# Altium schematic sheet Generator.SchDoc
size 420 x 297 mm; DocumentNumber: Audio core
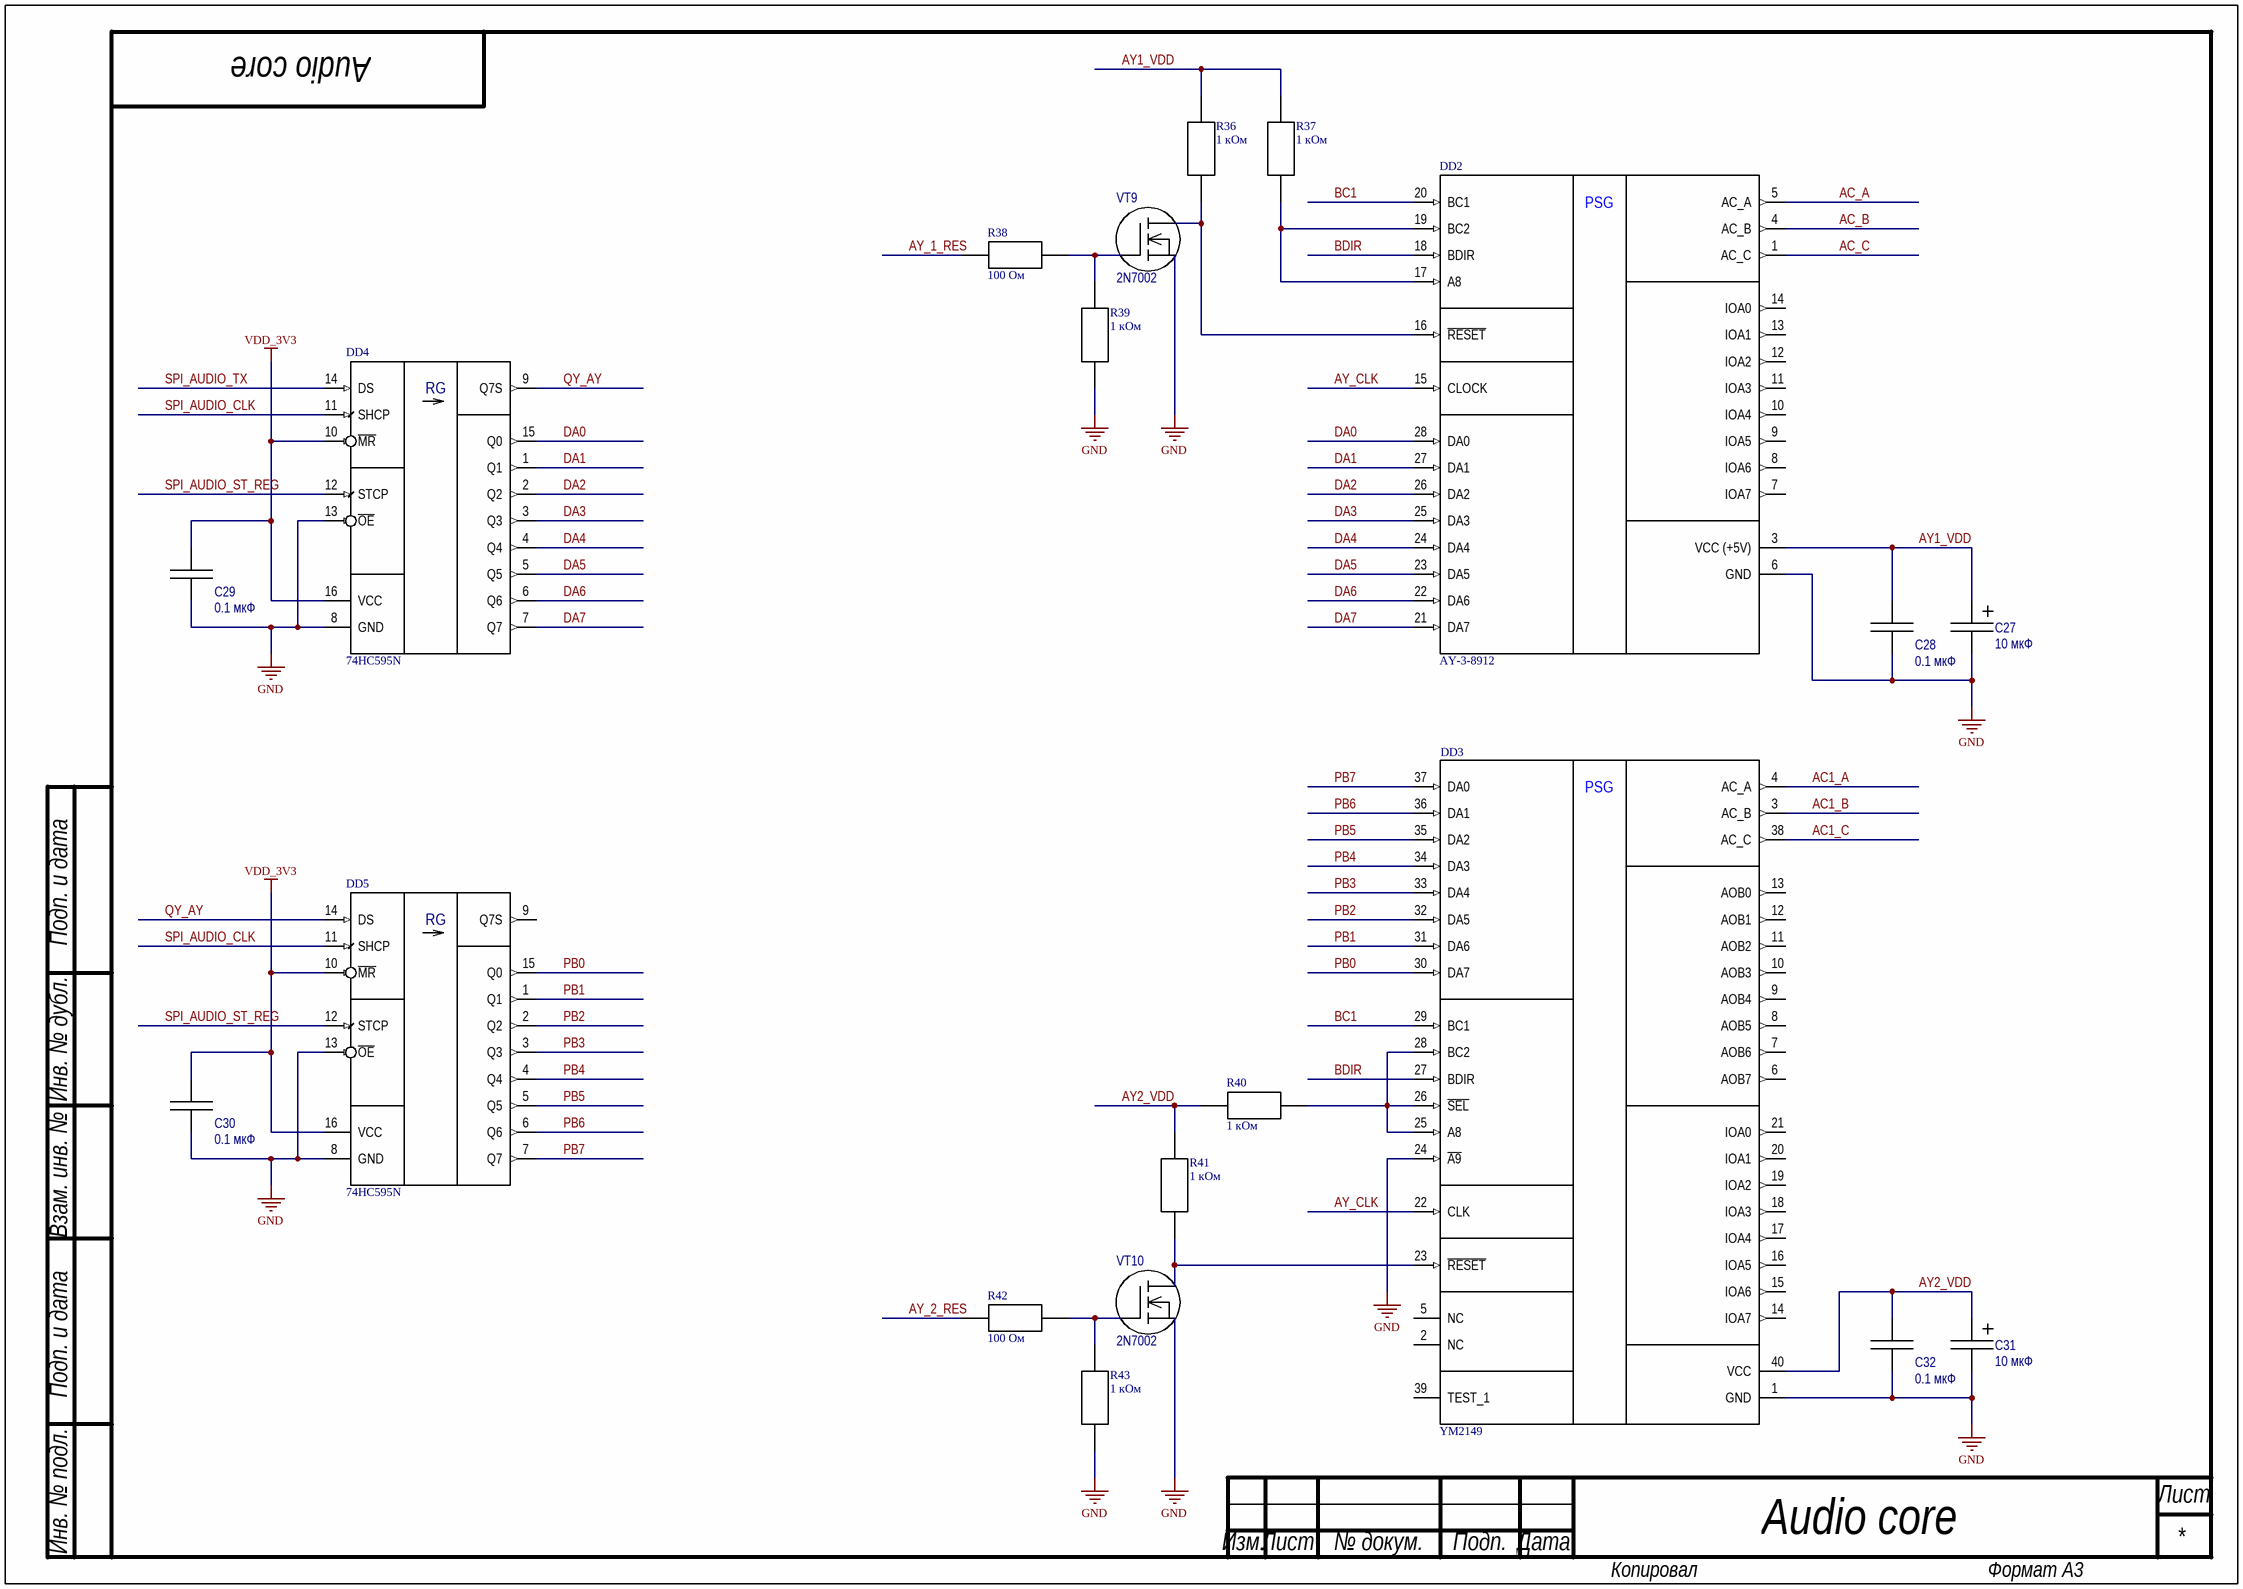
[diagram p0: Generator.SchDoc]

## Parts
C27  10 мкФ  [C TAN_C]
C28  0.1 мкФ  [C 1206]
C29  0.1 мкФ  [C 1206]
C30  0.1 мкФ  [C 1206]
C31  10 мкФ  [C TAN_C]
C32  0.1 мкФ  [C 1206]
DD2  AY-3-8912  [DIP-28]
DD3  YM2149  [DIP-40]
DD4  74HC595N  [SO16]
DD5  74HC595N  [SO16]
R36  1 кОм  [RES 0805]
R37  1 кОм  [RES 0805]
R38  100 Ом  [RES 0805]
R39  1 кОм  [RES 0805]
R40  1 кОм  [RES 0805]
R41  1 кОм  [RES 0805]
R42  100 Ом  [RES 0805]
R43  1 кОм  [RES 0805]
VT9  2N7002  [SOT-23]
VT10  2N7002  [SOT-23]

## Nets
GND: C27.2 C28.2 C29.2 C30.2 C31.2 C32.2 DD2.6(GND) DD3.1(GND) DD3.24(~{A9}) DD4.8(GND) DD4.13(~{OE}) DD5.8(GND) DD5.13(~{OE}) R39.1 R43.1 VT9.2(S) VT10.2(S)
VDD_3V3: C29.1 C30.1 DD4.10(~{MR}) DD4.16(VCC) DD5.10(~{MR}) DD5.16(VCC)
AC1_A: DD3.4(AC_A)
AC1_B: DD3.3(AC_B)
AC1_C: DD3.38(AC_C)
AC_A: DD2.5(AC_A)
AC_B: DD2.4(AC_B)
AC_C: DD2.1(AC_C)
AY1_VDD: C27.1 C28.1 DD2.3(VCC_(+5V)) R36.2 R37.1
AY2_VDD: C31.1 C32.1 DD3.40(VCC) R40.2 R41.2
AY_1_RES: R38.1
AY_2_RES: R42.1
AY_CLK: DD2.15(CLOCK) DD3.22(CLK)
BC1: DD2.20(BC1) DD3.29(BC1)
BDIR: DD2.18(BDIR) DD3.27(BDIR)
DA0: DD2.28(DA0) DD4.15(Q0)
DA1: DD2.27(DA1) DD4.1(Q1)
DA2: DD2.26(DA2) DD4.2(Q2)
DA3: DD2.25(DA3) DD4.3(Q3)
DA4: DD2.24(DA4) DD4.4(Q4)
DA5: DD2.23(DA5) DD4.5(Q5)
DA6: DD2.22(DA6) DD4.6(Q6)
DA7: DD2.21(DA7) DD4.7(Q7)
PB0: DD3.30(DA7) DD5.15(Q0)
PB1: DD3.31(DA6) DD5.1(Q1)
PB2: DD3.32(DA5) DD5.2(Q2)
PB3: DD3.33(DA4) DD5.3(Q3)
PB4: DD3.34(DA3) DD5.4(Q4)
PB5: DD3.35(DA2) DD5.5(Q5)
PB6: DD3.36(DA1) DD5.6(Q6)
PB7: DD3.37(DA0) DD5.7(Q7)
QY_AY: DD4.9(Q7S) DD5.14(DS)
SPI_AUDIO_CLK: DD4.11(SHCP) DD5.11(SHCP)
SPI_AUDIO_ST_REG: DD4.12(STCP) DD5.12(STCP)
SPI_AUDIO_TX: DD4.14(DS)
NetDD2_16: DD2.16(~{RESET}) R36.1 VT9.3(D)
NetDD2_17: DD2.17(A8) DD2.19(BC2) R37.2
NetDD3_23: DD3.23(~{RESET}) R41.1 VT10.3(D)
NetDD3_25: DD3.25(A8) DD3.26(~{SEL}) DD3.28(BC2) R40.1
NetR38_2: R38.2 R39.2 VT9.1(G)
NetR42_2: R42.2 R43.2 VT10.1(G)

Not connected (* = marked no-connect by the designer): DD2 7(IOA7) 8(IOA6) 9(IOA5) 10(IOA4) 11(IOA3) 12(IOA2) 13(IOA1) 14(IOA0); DD3 2(NC) 5(NC) 6(AOB7) 7(AOB6) 8(AOB5) 9(AOB4) 10(AOB3) 11(AOB2) 12(AOB1) 13(AOB0) 14(IOA7) 15(IOA6) 16(IOA5) 17(IOA4) 18(IOA3) 19(IOA2) 20(IOA1) 21(IOA0) 39(TEST_1); DD5 9(Q7S)

## Notes on the sheet
- Подп. и дата
- Инв. № дубл.
- Взам. инв. №
- Инв. № подл.
- Лист
- Изм.
- № докум.
- Подп.
- Дата
- Копировал
- Формат А3
- (in symbol 74HC595N) RG
- (in symbol AY-3-8912) PSG
- (in symbol YM2149) PSG

## Library data of the parts
C27 C31 = CAP TAN_C: SMD Tantalium Capacitor C; Manufacturer: /Укажите компанию-производителя/; Tolerance: /Укажите допуск в процентах/; Type: Конденсатор танталовый; ESR: /Укажите значение ЭПС/; Size: C; Temperature range: /Формат: -? ... ? °C/; Value: 10 мкФ
C28-C30 C32 = CAP 1206: SMD Capacitor 1206; Manufacturer: /Укажите компанию-производителя/; Tolerance: /Укажите допуск в процентах/; Temperature coefficient: /Формат: ±? ppm/°C/; Type: Конденсатор керамический; TC: /Укажите тип диэлектрика/; Size: 1206; Temperature range: /Формат: -? ... ? °C/; Value: 0.1 мкФ
R36-R43 = RES 0805
VT9 VT10 = 2N7002: 60 V, 300 mA N-channel Trench MOSFET; Manufacturer: NXP; Structure: Индуцированный канал n-типа; Type: Транзистор полевой с изолированным затвором; Max gate-to-source voltage: 30 В; Drain-to-source breakdown voltage: 60 В; Gate threshold voltage: 2 В; Max continuous drain current: 300 мА; Max pulsed drain current: 1,2 А; Power dissitipation: 0,83 Вт; Input capacitance: 31 пФ; Output capacitance: 6,8 пФ; Turn-on time: 2,5 нс; Reverse transfer capacitance: 3,5 пФ; Turn-off time: 11 нс; Rds: 2,8 Ом; Temperature range: -65 ... 150 °C